# EAGLE schematic bk-circ4-S (EAGLE 9.1.0)
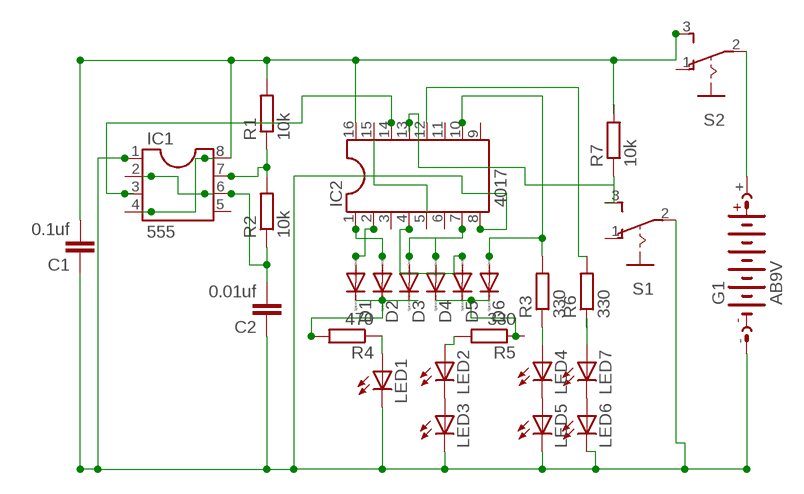
[diagram p0: schematic, sheet 1]

## Parts
C1  0.1uf  C-EU025-024X044  [C025-024X044]
C2  0.01uf  C-EU025-024X044  [C025-024X044]
D1  1N4004  [DO41-10]
D2  1N4004  [DO41-10]
D3  1N4004  [DO41-10]
D4  1N4004  [DO41-10]
D5  1N4004  [DO41-10]
D6  1N4004  [DO41-10]
G1  AB9V  [AB9V]
IC1  555  DIL8  [DIL08]
IC2  4017  DIL16  [DIL16]
LED1  LED3MM  [LED3MM]
LED2  LED3MM  [LED3MM]
LED3  LED3MM  [LED3MM]
LED4  LED3MM  [LED3MM]
LED5  LED3MM  [LED3MM]
LED6  LED3MM  [LED3MM]
LED7  LED3MM  [LED3MM]
R1  10k  R-EU_0207/7  [0207/7]
R2  10k  R-EU_0207/7  [0207/7]
R3  330  R-EU_0207/7  [0207/7]
R4  470  R-EU_0207/7  [0207/7]
R5  330  R-EU_0207/7  [0207/7]
R6  330  R-EU_0207/7  [0207/7]
R7  10k  R-EU_0207/7  [0207/7]
S1  255SB  [255SB]
S2  255SB  [255SB]

## Nets
N$3: C1.2 IC1.8 IC2.16 R1.2 S2.3(S)
N$4: IC1.7 R1.1 R2.2
N$5: C2.2 IC1.6 R2.1
N$6: LED4.K(C) LED5.A
N$7: LED2.K(C) LED3.A
N$8: LED6.A LED7.K(C)
N$9: IC1.3 IC2.14
N$12: IC2.2
N$13: IC2.1
N$14: IC2.7
N$15: IC2.4
N$16: IC2.10 R3.2
N$18: IC2.12 R6.2
N$20: IC2.13 R7.1 S1.3(S)
N$21: C1.1 C2.1 G1.- IC1.1 IC2.8 LED1.K(C) LED3.K(C) LED5.K(C) LED6.K(C) S1.2(P)
N$23: G1.+ S2.2(P)
N$26: LED4.A R3.1
N$27: LED7.A
N$28: LED1.A R4.1
N$29: D1.C D2.C R4.2
N$30: D4.C D6.C
N$31: LED2.A R5.2
Unconnected: D1.A D2.A D3.A D3.C D4.A D5.A D5.C D6.A IC1.2 IC1.4 IC1.5 IC2.3 IC2.5 IC2.6 IC2.9 IC2.11 IC2.15 R5.1 R6.1 R7.2 S1.1(O) S2.1(O)

## Library data of the parts
C1 C2 = rcl:C-EU: CAPACITOR, European symbol; SPICEPREFIX: C
D1-D6 = diode:1N4004: DIODE general purpose rectifier, 1 A
G1 = battery:AB9V: 9-V BATTERY CLIP
IC1 = ic-package:DIL8: Dual In Line / Socket
IC2 = ic-package:DIL16: Dual In Line / Socket
LED1-LED7 = led:LED: LED OSRAM: - CHIPLED LG R971, LG N971, LY N971, LG Q971, LY Q971, LO R971, LY R971 LH N974, LH R974 LS Q976, LO Q976, LY Q976 LO Q996 - Hyper CHIPLED LW Q18S LB Q993, LB Q99A, LB R99A - SideLED LS A670, LO A670, LY A670, LG A670, LP A670 LB A673, LV A673, LT A673, LW A673 LH A674 LY A675 LS A676, LA A676, LO A676, LY A676, LW A676 LS A679, LY A679, LG A679 - Hyper Micro SIDELED® LS Y876, LA Y876, LO Y876, LY Y876 LT Y87S - SmartLED LW L88C, LW L88S LB L89C, LB L89S, LG L890 LS L89K, LO L89K, LY L89K LS L896, LA L896, LO L896, LY L896 - TOPLED LS T670, LO T670, LY T670, LG T670, LP T670 LSG T670, LSP T670, LSY T670, LOP T670, LYG T670 LG T671, LOG T671, LSG T671 LB T673, LV T673, LT T673, LW T673 LH T674 LS T676, LA T676, LO T676, LY T676, LB T676, LH T676, LSB T676, LW T676 LB T67C, LV T67C, LT T67C, LS T67K, LO T67K, LY T67K, LW E67C LS E67B, LA E67B, LO E67B, LY E67B, LB E67C, LV E67C, LT E67C LW T67C LS T679, LY T679, LG T679 LS T770, LO T770, LY T770, LG T770, LP T770 LB T773, LV T773, LT T773, LW T773 LH T774 LS E675, LA E675, LY E675, LS T675 LS T776, LA T776, LO T776, LY T776, LB T776 LHGB T686 LT T68C, LB T68C - Hyper Mini TOPLED® LB M676 - Mini TOPLED Santana® LG M470 LS M47K, LO M47K, LY M47K Source: http://www.osram.convergy.de LUXEON: - LUMILED® LXK2-PW12-R00, LXK2-PW12-S00, LXK2-PW14-U00, LXK2-PW14-V00 LXK2-PM12-R00, LXK2-PM12-S00, LXK2-PM14-U00 LXK2-PE12-Q00, LXK2-PE12-R00, LXK2-PE12-S00, LXK2-PE14-T00, LXK2-PE14-U00 LXK2-PB12-K00, LXK2-PB12-L00, LXK2-PB12-M00, LXK2-PB14-N00, LXK2-PB14-P00, LXK2-PB14-Q00 LXK2-PR12-L00, LXK2-PR12-M00, LXK2-PR14-Q00, LXK2-PR14-R00 LXK2-PD12-Q00, LXK2-PD12-R00, LXK2-PD12-S00 LXK2-PH12-R00, LXK2-PH12-S00 LXK2-PL12-P00, LXK2-PL12-Q00, LXK2-PL12-R00 Source: www.luxeon.com KINGBRIGHT: KA-3528ASYC Source: www.kingbright.com
R1-R7 = rcl:R-EU_: RESISTOR, European symbol; SPICEPREFIX: R
S1 S2 = switch:255SB: SLIDING SWITCH Distributor Buerklin, 11G810